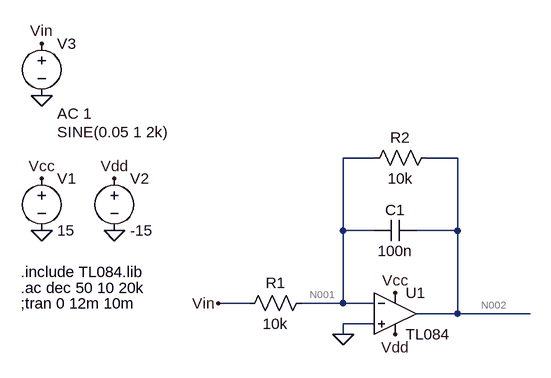
[diagram p0: schematic Dephasage.asc]
Dephasage.asc, the LTspice schematic file:
Version 4
SHEET 1 880 680
WIRE 160 16 112 16
WIRE 288 16 240 16
WIRE 112 128 112 16
WIRE 160 128 112 128
WIRE 288 128 288 16
WIRE 288 128 224 128
WIRE -32 240 -80 240
WIRE 112 240 112 128
WIRE 112 240 48 240
WIRE 160 240 112 240
WIRE 288 256 288 128
WIRE 288 256 224 256
WIRE 400 256 288 256
WIRE 160 272 112 272
WIRE 112 288 112 272
FLAG 192 224 Vcc
FLAG 192 288 Vdd
FLAG 112 288 0
FLAG -352 -80 0
FLAG -352 128 0
FLAG -240 128 0
FLAG -240 48 Vdd
FLAG -352 48 Vcc
FLAG -352 -160 Vin
FLAG -80 240 Vin
SYMBOL res 64 224 R90
WINDOW 0 0 56 VBottom 2
WINDOW 3 32 56 VTop 2
SYMATTR InstName R1
SYMATTR Value 10k
SYMBOL res 256 0 R90
WINDOW 0 0 56 VBottom 2
WINDOW 3 32 56 VTop 2
SYMATTR InstName R2
SYMATTR Value 10k
SYMBOL cap 224 112 R90
WINDOW 0 0 32 VBottom 2
WINDOW 3 32 32 VTop 2
SYMATTR InstName C1
SYMATTR Value 100n
SYMBOL Opamps\\opamp2 192 192 R0
SYMATTR InstName U1
SYMATTR Value TL084
SYMBOL voltage -352 32 R0
WINDOW 123 0 0 Left 0
WINDOW 39 0 0 Left 0
SYMATTR InstName V1
SYMATTR Value 15
SYMBOL voltage -240 32 R0
WINDOW 123 0 0 Left 0
WINDOW 39 0 0 Left 0
SYMATTR InstName V2
SYMATTR Value -15
SYMBOL voltage -352 -176 R0
WINDOW 123 24 124 Left 2
WINDOW 39 0 0 Left 0
WINDOW 3 24 152 Left 2
SYMATTR Value2 AC 1
SYMATTR Value SINE(0.05 1 2k)
SYMATTR InstName V3
TEXT -384 216 Left 2 !.ac dec 50 10 20k
TEXT -384 240 Left 2 !;tran 0 12m 10m
TEXT -384 192 Left 2 !.include TL084.lib

The netlist it stands for:
* Dephasage.asc
R1 N001 Vin 10k
R2 N002 N001 10k
C1 N002 N001 100n
XU1 0 N001 Vcc Vdd N002 TL084  ; pins In+ In- V+ V- OUT
V1 Vcc 0 15
V2 Vdd 0 -15
V3 Vin 0 SINE(0.05 1 2k) AC 1
.ac dec 50 10 20k
;tran 0 12m 10m
.include TL084.lib
.backanno
.end

* Results of the author's LTspice run, read from the files saved beside the schematic
* Operating Point, zero values left out:
*   V(n001) = 11.2 µV
*   V(vin) = 50 mV
*   V(n002) = -49.98 mV
*   V(vdd) = -15 V
*   V(vcc) = 15 V
*   I(R2) = -4.999 µA
*   I(R1) = -4.999 µA
*   I(V3) = -4.999 µA
*   I(V2) = 14.19 mA
*   I(V1) = -14.19 mA
*   Ix(u1:IN+) = 45.05 pA
*   Ix(u1:IN-) = 45.05 pA
*   Ix(u1:V+) = 14.19 mA
*   Ix(u1:V-) = -14.19 mA
*   Ix(u1:OUT) = 4.999 µA
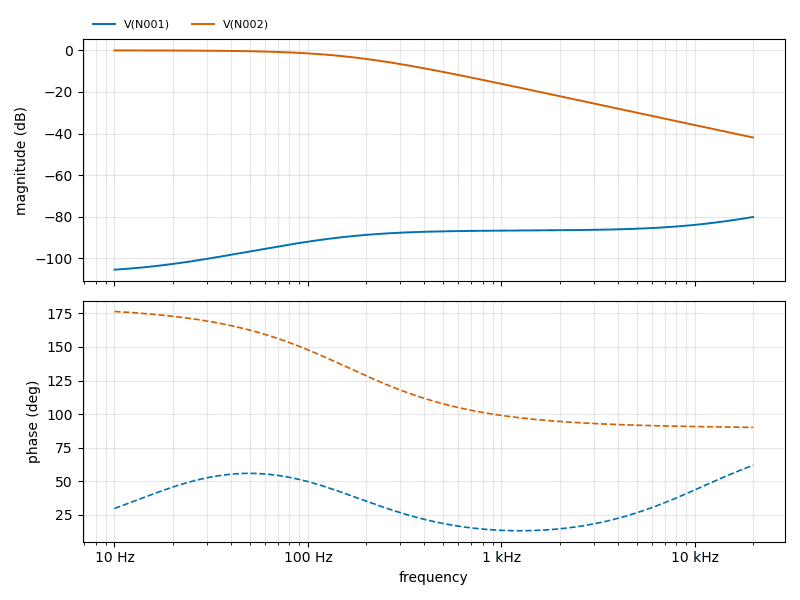
[diagram p1: AC Analysis of Dephasage.asc, plotted from the saved traces]
* AC Analysis, 1 run:
*   V(N001): -105.41 dB at 10 Hz, -80.10 dB at 20 kHz, peak -80.10 dB at 20 kHz, 3 dB below the peak at 11.91 kHz
*   V(N002): -0.02 dB at 10 Hz, -41.89 dB at 20 kHz, peak -0.02 dB at 10 Hz, 3 dB below the peak at 159.8 Hz